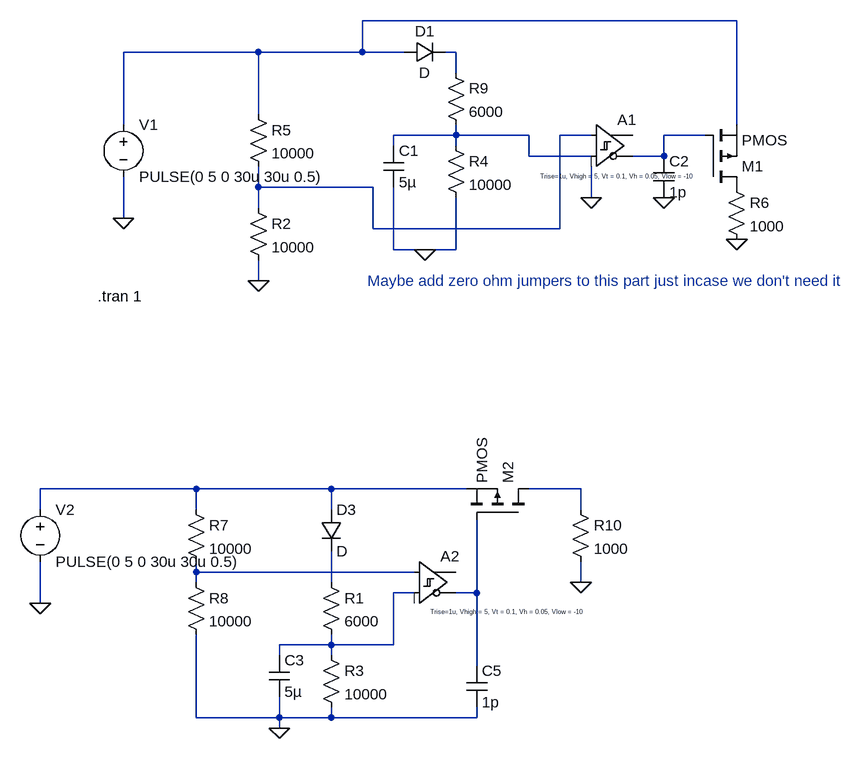
[diagram p0: schematic Cross Conduction Prototype 1.asc]
Cross Conduction Prototype 1.asc, the LTspice schematic file:
Version 4.1
SHEET 1 1412 1156
WIRE 1024 48 448 48
WIRE 288 96 80 96
WIRE 448 96 448 48
WIRE 448 96 288 96
WIRE 512 96 448 96
WIRE 592 96 576 96
WIRE 592 128 592 96
WIRE 288 192 288 96
WIRE 80 208 80 96
WIRE 1024 208 1024 48
WIRE 592 224 592 208
WIRE 592 224 496 224
WIRE 704 224 592 224
WIRE 800 224 752 224
WIRE 976 224 912 224
WIRE 496 240 496 224
WIRE 592 240 592 224
WIRE 704 256 704 224
WIRE 800 256 704 256
WIRE 912 256 912 224
WIRE 912 256 864 256
WIRE 288 304 288 272
WIRE 464 304 288 304
WIRE 800 320 800 272
WIRE 288 336 288 304
WIRE 80 352 80 288
WIRE 464 368 464 304
WIRE 752 368 752 224
WIRE 752 368 464 368
WIRE 496 400 496 304
WIRE 544 400 496 400
WIRE 592 400 592 320
WIRE 592 400 544 400
WIRE 288 448 288 416
WIRE 192 768 -48 768
WIRE 400 768 192 768
WIRE 608 768 400 768
WIRE 784 768 704 768
WIRE -48 800 -48 768
WIRE 192 800 192 768
WIRE 400 800 400 768
WIRE 784 800 784 768
WIRE 192 896 192 880
WIRE 528 896 192 896
WIRE 192 912 192 896
WIRE 400 912 400 864
WIRE 784 912 784 880
WIRE 528 928 496 928
WIRE 624 928 624 816
WIRE 624 928 592 928
WIRE -48 944 -48 880
WIRE 400 1008 400 992
WIRE 400 1008 320 1008
WIRE 496 1008 496 928
WIRE 496 1008 400 1008
WIRE 320 1024 320 1008
WIRE 400 1024 400 1008
WIRE 624 1040 624 928
WIRE 192 1120 192 992
WIRE 320 1120 320 1088
WIRE 320 1120 192 1120
WIRE 400 1120 400 1104
WIRE 400 1120 320 1120
WIRE 624 1120 624 1104
WIRE 624 1120 400 1120
WIRE 320 1136 320 1120
FLAG 288 448 0
FLAG 80 352 0
FLAG 544 400 0
FLAG 800 320 0
FLAG 1024 384 0
FLAG 912 320 0
FLAG 320 1136 0
FLAG -48 944 0
FLAG 784 912 0
SYMBOL voltage 80 192 R0
WINDOW 123 0 0 Left 0
WINDOW 39 0 0 Left 0
SYMATTR InstName V1
SYMATTR Value PULSE(0 5 0 30u 30u 0.5)
SYMBOL Digital\\diffschmitt 800 176 R0
WINDOW 3 153 111 Right 0
SYMATTR Value Trise=1u, Vhigh = 5, Vt = 0.1, Vh = 0.05, Vlow = -10
SYMATTR InstName A1
SYMBOL res 272 320 R0
SYMATTR InstName R2
SYMATTR Value 10000
SYMBOL res 576 224 R0
SYMATTR InstName R4
SYMATTR Value 10000
SYMBOL cap 480 240 R0
SYMATTR InstName C1
SYMATTR Value 5µ
SYMBOL diode 512 112 R270
WINDOW 0 32 32 VTop 2
WINDOW 3 0 32 VBottom 2
SYMATTR InstName D1
SYMBOL pmos 976 304 M180
SYMATTR InstName M1
SYMBOL res 1008 288 R0
SYMATTR InstName R6
SYMATTR Value 1000
SYMBOL cap 896 256 R0
SYMATTR InstName C2
SYMATTR Value 1p
SYMBOL Digital\\diffschmitt 528 848 R0
WINDOW 3 256 109 Right 0
SYMATTR Value Trise=1u, Vhigh = 5, Vt = 0.1, Vh = 0.05, Vlow = -10
SYMATTR InstName A2
SYMBOL diode 384 800 R0
SYMATTR InstName D3
SYMBOL res 272 176 R0
SYMATTR InstName R5
SYMATTR Value 10000
SYMBOL res 176 784 R0
SYMATTR InstName R7
SYMATTR Value 10000
SYMBOL res 176 896 R0
SYMATTR InstName R8
SYMATTR Value 10000
SYMBOL res 576 112 R0
SYMATTR InstName R9
SYMATTR Value 6000
SYMBOL res 384 896 R0
SYMATTR InstName R1
SYMATTR Value 6000
SYMBOL res 384 1008 R0
SYMATTR InstName R3
SYMATTR Value 10000
SYMBOL cap 304 1024 R0
SYMATTR InstName C3
SYMATTR Value 5µ
SYMBOL pmos 704 816 M270
SYMATTR InstName M2
SYMBOL cap 608 1040 R0
SYMATTR InstName C5
SYMATTR Value 1p
SYMBOL voltage -48 784 R0
WINDOW 123 0 0 Left 0
WINDOW 39 0 0 Left 0
SYMATTR InstName V2
SYMATTR Value PULSE(0 5 0 30u 30u 0.5)
SYMBOL res 768 784 R0
SYMATTR InstName R10
SYMATTR Value 1000
TEXT 40 472 Left 2 !.tran 1
TEXT 456 448 Left 2 ;Maybe add zero ohm jumpers to this part just incase we don't need it

The netlist it stands for:
* Cross Conduction Prototype 1.asc
V1 N001 0 PULSE(0 5 0 30u 30u 0.5)
A1 N004 N003 0 0 0 N005 0 0 SCHMITT Trise=1u, Vhigh = 5, Vt = 0.1, Vh = 0.05, Vlow = -10
R2 N004 0 10000
R4 N003 0 10000
C1 N003 0 5µ
D1 N001 N002 D
M1 P001 N005 N001 N001 PMOS
R6 P001 0 1000
C2 N005 0 1p
A2 N008 N010 0 0 0 N011 0 0 SCHMITT Trise=1u, Vhigh = 5, Vt = 0.1, Vh = 0.05, Vlow = -10
D3 N006 N009 D
R5 N001 N004 10000
R7 N006 N008 10000
R8 N008 0 10000
R9 N002 N003 6000
R1 N009 N010 6000
R3 N010 0 10000
C3 N010 0 5µ
M2 N007 N011 N006 N006 PMOS
C5 N011 0 1p
V2 N006 0 PULSE(0 5 0 30u 30u 0.5)
R10 N007 0 1000
.model D D
.lib standard.dio
.model NMOS NMOS
.model PMOS PMOS
.lib standard.mos
.tran 1
* Maybe add zero ohm jumpers to this part just incase we don't need it
.backanno
.end